# EAGLE design esp32-tft+gps (EAGLE 9.6.2)
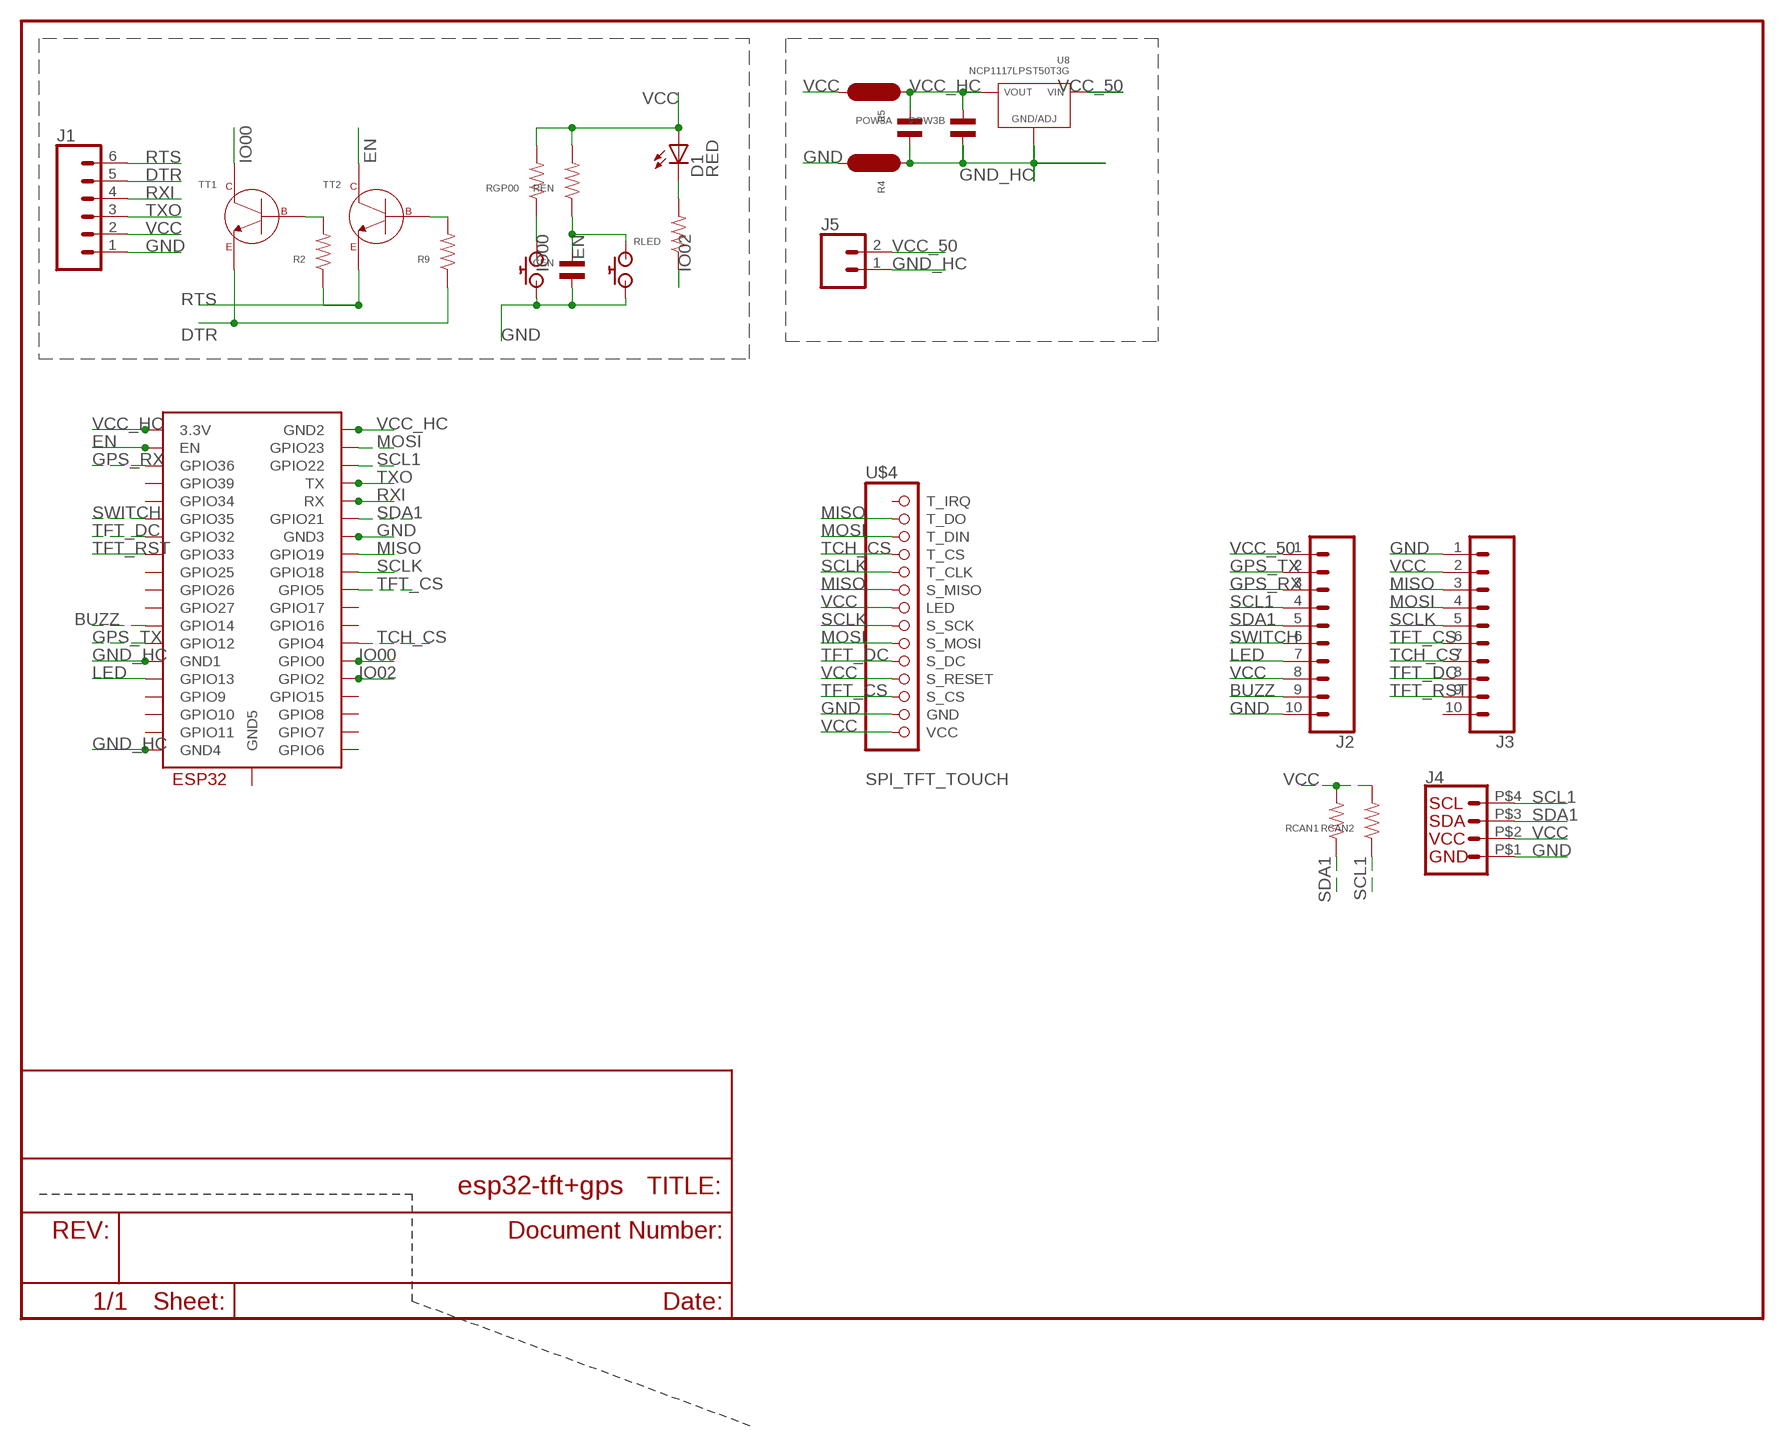
[diagram p0: schematic, sheet 1]

## Parts
CEN  CAPACITOR_NP_0603  [C0603]
D1  RED  LED-RED0603  [LED-0603]
J1  CONN_06  [1X6-1.25MM-SMD]
J2  CONN_10  [1X10-1.25MM]
J3  CONN_10  [1X10-1.25MM]
J4  Vertical Qwiic Connector  QWIIC_CONNECTORJST04_1MM_HOLE  [JST04_1MM_HOLES]
J5  CONN_02  [1X02]
POW3A  CAPACITOR_NP_0603  [C0603]
POW3B  CAPACITOR_NP_0603  [C0603]
R2  RESISTOR_0603  [R0603]
R4  JUMPER  [R0603_JMP]
R5  JUMPER  [R0603_JMP]
R9  RESISTOR_0603  [R0603]
RCAN1  RESISTOR_0603  [R0603]
RCAN2  RESISTOR_0603  [R0603]
REN  RESISTOR_0603  [R0603]
RGP00  RESISTOR_0603  [R0603]
RLED  RESISTOR_0603  [R0603]
TT1  MF-DSC-SOT233-MMBT3904  NPN_BJTMMBT3904_SOT-23-3  [SOT-23-3]
TT2  MF-DSC-SOT233-MMBT3904  NPN_BJTMMBT3904_SOT-23-3  [SOT-23-3]
U8  NCP1117LPST50T3G  [SOT-223-3]
U$1  AMAZON_BUTTONB2010  [C2010]
U$2  AMAZON_BUTTONB2010  [C2010]
U$3  ESP32-WROOM  [ESP32-WROOM]
U$4  SPI_TFT_TOUCH  [1X14_ROUND_70]

## Nets
BUZZ: J2.9 U$3.IO14(GPIO14)
DTR: J1.5 R9.P$1 TT1.P$2(EMITTER)
EN: CEN.P$1 REN.P$1 TT2.P$3(COLLECTOR) U$2.P$1 U$3.EN
GND: CEN.P$2 J1.1 J2.10 J3.1 J4.P$1 R4.P$2 U$1.P$2 U$2.P$2 U$3.GND3 U$4.13(GND)
GND_HC [hc]: J5.1 POW3A.P$2 POW3B.P$2 R4.P$1 U8.P$2(GND/ADJ) U$3.GND1 U$3.GND4
GPS_RX: J2.3 U$3.SENSOR_VP(GPIO36)
GPS_TX: J2.2 U$3.IO12(GPIO12)
IO00: RGP00.P$1 TT1.P$3(COLLECTOR) U$1.P$1 U$3.IO0(GPIO0)
IO02: RLED.P$1 U$3.IO2(GPIO2)
LED: J2.7 U$3.IO13(GPIO13)
MISO: J3.3 U$3.IO19(GPIO19) U$4.2(T_DO) U$4.6(S_MISO)
MOSI: J3.4 U$3.IO23(GPIO23) U$4.3(T_DIN) U$4.9(S_MOSI)
N$2: D1.C RLED.P$2
N$3: R2.P$2 TT1.P$1(BASE)
N$6: R9.P$2 TT2.P$1(BASE)
RTS: J1.6 R2.P$1 TT2.P$2(EMITTER)
RXI: J1.4 U$3.RX
SCL1: J2.4 J4.P$4 RCAN2.P$1 U$3.IO22(GPIO22)
SCLK: J3.5 U$3.IO18(GPIO18) U$4.5(T_CLK) U$4.8(S_SCK)
SDA1: J2.5 J4.P$3 RCAN1.P$1 U$3.IO21(GPIO21)
SWITCH: J2.6 U$3.IO35(GPIO35)
TCH_CS: J3.7 U$3.IO4(GPIO4) U$4.4(T_CS)
TFT_CS: J3.6 U$3.IO5(GPIO5) U$4.12(S_CS)
TFT_DC: J3.8 U$3.IO32(GPIO32) U$4.10(S_DC)
TFT_RST: J3.9 U$3.IO33(GPIO33)
TXO: J1.3 U$3.TX
VCC: D1.A J1.2 J2.8 J3.2 J4.P$2 R5.P$2 RCAN1.P$2 RCAN2.P$2 REN.P$2 RGP00.P$2 U$4.7(LED) U$4.11(S_RESET) U$4.14(VCC)
VCC_50 [hc]: J2.1 J5.2 U8.P$4(VIN)
VCC_HC [hc]: POW3A.P$1 POW3B.P$1 R5.P$1 U8.P$1(VOUT) U8.P$3(VOUT) U$3.3V3(3.3V) U$3.GND2
Unconnected: J3.10 U$3.CLK(GPIO6) U$3.CMD(GPIO11) U$3.GND5 U$3.IO15(GPIO15) U$3.IO16(GPIO16) U$3.IO17(GPIO17) U$3.IO25(GPIO25) U$3.IO26(GPIO26) U$3.IO27(GPIO27) U$3.IO34(GPIO34) U$3.SD0(GPIO7) U$3.SD1(GPIO8) U$3.SD2(GPIO9) U$3.SD3(GPIO10) U$3.SENSOR_VN(GPIO39) U$4.1(T_IRQ)

## Library data of the parts
CEN POW3A POW3B = MF_Passives:CAPACITOR_NP: Library: MF_Passives Description: Device for Non-Polarized Capacitors. Manufacture part number (MPN) can be added via Attributes. Check https://factory.macrofab.com/parts for the house parts list.; POPULATE: 1
D1 = 00jim:LED-RED: Assorted Red LEDs LilyPad 1206- DIO-09912 1206- DIO-00809 0603- DIO-00819; PROD_ID: DIO-00819
J1 = 00jim:CONN_06: Multi connection point. Often used as Generic Header-pin footprint for 0.1 inch spaced/style header connections On any of the 0.1 inch spaced packages, you can populate with these: Break Away Headers - Straight <https://www.sparkfun.com/products/116> (PRT-00116) Break Away Male Headers - Right Angle <https://www.sparkfun.com/products/553> (PRT-00553) Female Headers <https://www.sparkfun.com/products/115> (PRT-00115) Break Away Headers - Machine Pin <https://www.sparkfun.com/products/117> (PRT-00117) Break Away Female Headers - Swiss Machine Pin <https://www.sparkfun.com/products/743> (PRT-00743) Arduino Stackable Header - 6 Pin <https://www.sparkfun.com/products/9280> (PRT-09280) For SCREWTERMINALS and SPRING TERMINALS visit here: Screw Terimnals on SparkFun.com <https://www.sparkfun.com/search/results?term=Screw+Terminals> (5mm/3.5mm/2.54mm spacing) This device is also useful as a general connection point to wire up your design to another part of your project. Our various solder wires solder well into these plated through hole pads. Hook-Up Wire - Assortment (Stranded, 22 AWG) <https://www.sparkfun.com/products/11375> (PRT-11375) Hook-Up Wire - Assortment (Solid Core, 22 AWG) <https://www.sparkfun.com/products/11367> (PRT-11367) View the entire wire category on our website here <https://www.sparkfun.com/categories/141>
J2 J3 = SparkFun-Connectors:CONN_10: Multi connection point. Often used as Generic Header-pin footprint for 0.1 inch spaced/style header connections On any of the 0.1 inch spaced packages, you can populate with these: Break Away Headers - Straight <https://www.sparkfun.com/products/116> (PRT-00116) Break Away Male Headers - Right Angle <https://www.sparkfun.com/products/553> (PRT-00553) Female Headers <https://www.sparkfun.com/products/115> (PRT-00115) Break Away Headers - Machine Pin <https://www.sparkfun.com/products/117> (PRT-00117) Break Away Female Headers - Swiss Machine Pin <https://www.sparkfun.com/products/743> (PRT-00743) Arduino Stackable Header - 10 Pin <https://www.sparkfun.com/products/11376> (PRT-11376) For SCREWTERMINALS and SPRING TERMINALS visit here: Screw Terimnals on SparkFun.com <https://www.sparkfun.com/search/results?term=Screw+Terminals> (5mm/3.5mm/2.54mm spacing) This device is also useful as a general connection point to wire up your design to another part of your project. Our various solder wires solder well into these plated through hole pads. Hook-Up Wire - Assortment (Stranded, 22 AWG) <https://www.sparkfun.com/products/11375> (PRT-11375) Hook-Up Wire - Assortment (Solid Core, 22 AWG) <https://www.sparkfun.com/products/11367> (PRT-11367) View the entire wire category on our website here <https://www.sparkfun.com/categories/141> Special notes: Molex polarized connector foot print use with SKU : PRT-08231 with associated crimp pins and housings. 1MM SMD Version SKU: PRT-10208 NOTES ON THE VARIANTS LOCK and LOCK_LONGPADS... This footprint was designed to help hold the alignment of a through-hole component (i.e. 6-pin header) while soldering it into place. You may notice that each hole has been shifted either up or down by 0.005 of an inch from it's more standard position (which is a perfectly straight line). This slight alteration caused the pins (the squares in the middle) to touch the edges of the holes. Because they are alternating, it causes a "brace" to hold the component in place. 0.005 has proven to be the perfect amount of "off-center" position when using our standard breakaway headers. Although looks a little odd when you look at the bare footprint, once you have a header in there, the alteration is very hard to notice. Also,if you push a header all the way into place, it is covered up entirely on the bottom side.
J4 = 00jim:QWIIC_CONNECTOR: SparkFun I2C Standard Qwiic Connector An SMD 1mm pitch JST connector makes it easy and quick (get it? Qwiic?) to connect I2C devices to each other. The Qwiic system <http://www.sparkfun.com/qwiic> enables fast and solderless connection between popular platforms and various sensors and actuators. We carry 200mm <https://www.sparkfun.com/products/14204>, 100mm <https://www.sparkfun.com/products/14205>, 50mm <https://www.sparkfun.com/products/14206>, and breadboard friendly <https://www.sparkfun.com/products/14207> Qwiic cables. We also offer 10 pcs strips <https://www.sparkfun.com/products/14323> the SMD connectors.
J5 = SparkFun-Connectors:CONN_02: Multi connection point. Often used as Generic Header-pin footprint for 0.1 inch spaced/style header connections On any of the 0.1 inch spaced packages, you can populate with these: Break Away Headers - Straight <https://www.sparkfun.com/products/116> (PRT-00116) Break Away Male Headers - Right Angle <https://www.sparkfun.com/products/553> (PRT-00553) Female Headers <https://www.sparkfun.com/products/115> (PRT-00115) Break Away Headers - Machine Pin <https://www.sparkfun.com/products/117> (PRT-00117) Break Away Female Headers - Swiss Machine Pin <https://www.sparkfun.com/products/743> (PRT-00743) For SCREWTERMINALS and SPRING TERMINALS visit here: Screw Terimnals on SparkFun.com <https://www.sparkfun.com/search/results?term=Screw+Terminals> (5mm/3.5mm/2.54mm spacing) This device is also useful as a general connection point to wire up your design to another part of your project. Our various solder wires solder well into these plated through hole pads. Hook-Up Wire - Assortment (Stranded, 22 AWG) <https://www.sparkfun.com/products/11375> (PRT-11375) Hook-Up Wire - Assortment (Solid Core, 22 AWG) <https://www.sparkfun.com/products/11367> (PRT-11367) View the entire wire category on our website here <https://www.sparkfun.com/categories/141> Special notes: Molex polarized connector foot print use with: PRT-08233 with associated crimp pins and housings. 2.54_SCREWTERM for use with PRT-10571. 3.5mm Screw Terminal footprints for PRT-08084 5mm Screw Terminal footprints for use with PRT-08432
R2 R9 RCAN1 RCAN2 REN RGP00 RLED = 00jim:RESISTOR: Library: MF_Passives Description: Device for Resistors. Manufacture part number (MPN), Voltage, Tolerance, and Wattage Rating can be added via Attributes. Check https://factory.macrofab.com/parts for the house parts list.; POPULATE: 1
R4 R5 = 00jim:JUMPER: Library: MF_Passives Description: Device for Resistors. Manufacture part number (MPN), Voltage, Tolerance, and Wattage Rating can be added via Attributes. Check https://factory.macrofab.com/parts for the house parts list.
TT1 TT2 = MF_Discrete_Semiconductor:NPN_BJT: Library: MF_Discrete_Semiconductor Description: Device for Single NPN BJT Transistors. Manufacture part number (MFG#) can be added via Attributes.; HOUSEPART: YES; MPN: MF-DSC-SOT233-MMBT3904; POPULATE: 1; URL: https://factory.macrofab.com/part/MF-DSC-SOT233-MMBT3904
U8 = MF_IC_Power:NCP1117LP: Manufacturer Part #: NCP1117LP Manufacturer: ON Semiconductor Description: LDO Voltage Regulators; HOUSEPART: NO; MPN: NCP1117LPST50T3G; POPULATE: 1; URL: http://www.onsemi.com/pub_link/Collateral/NCP1117LP-D.PDF
U$1 U$2 = 00jim:AMAZON_BUTTON
U$3 = ESP32:ESP32-WROOM
U$4 = 00jim:SPI_TFT_TOUCH

## Net classes
0 default: width 0.229 mm
1 vcc: width 0.254 mm
3 hc: width 0.508 mm

## Board
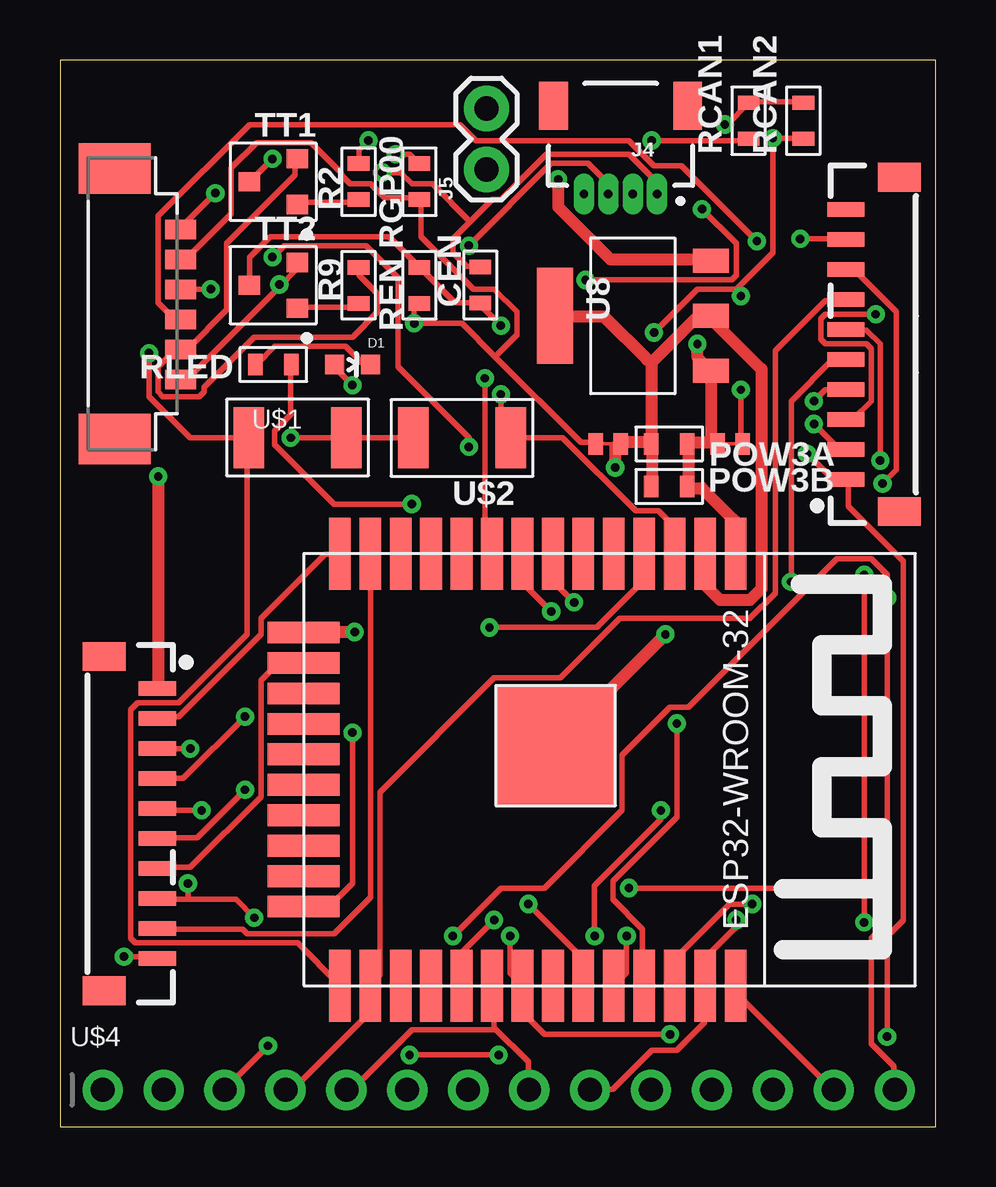
[diagram p1: board, top side]
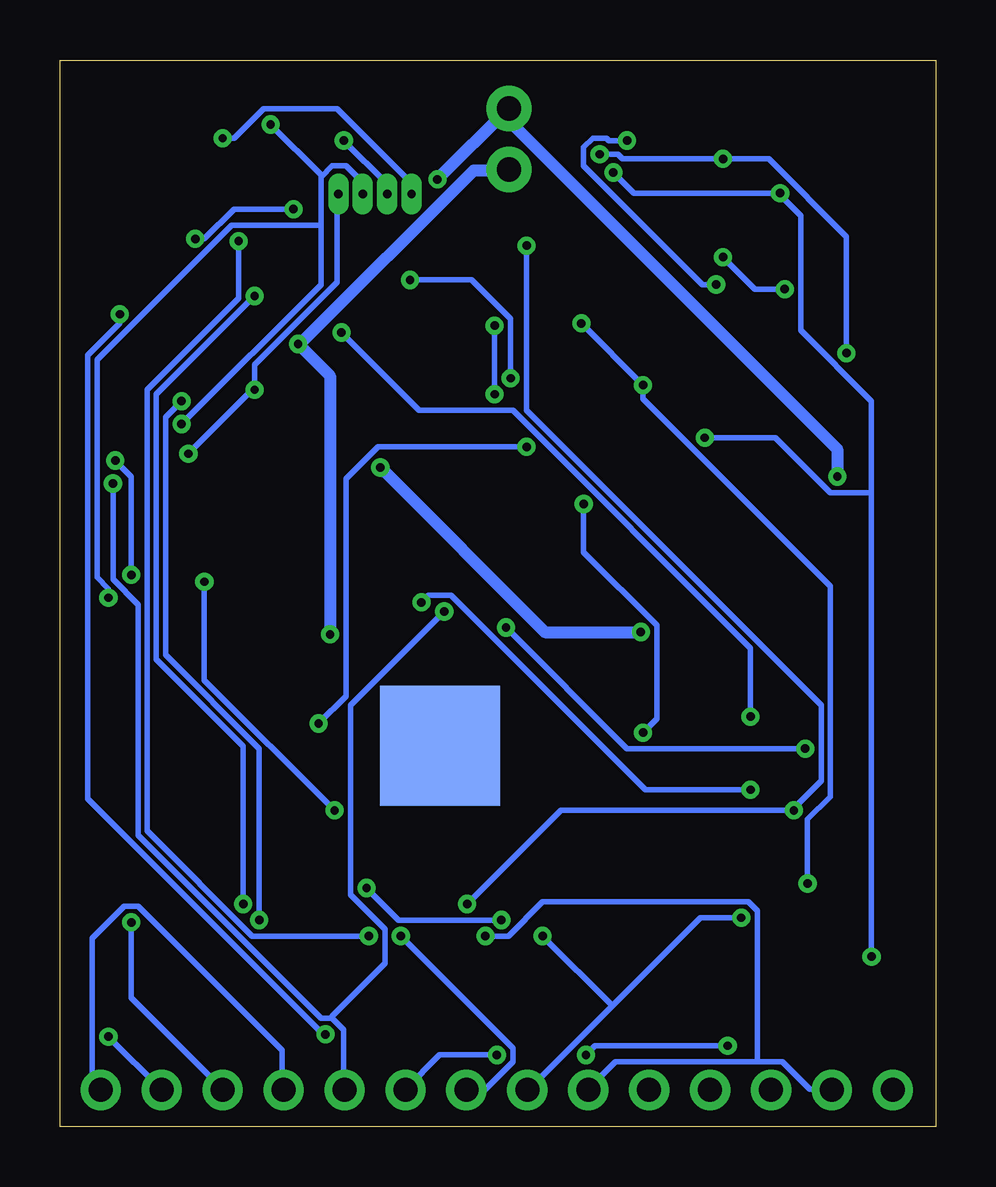
[diagram p2: board, bottom side, seen from below]

Size 36.5 x 44.44 mm. Coordinates in mm from the lower left corner, seen from the top.
Outline: 0,0 36.5,0 36.5,44.44 0,44.44 0,0
Copper layers (1*16): Top 0.035mm / dielectric 1.5mm / Bottom 0.035mm
Design rules "default *": minimum track width 6mil, minimum drill 0.35mm, track to track 6mil, track to pad 6mil, pad to pad 6mil, via to via 6mil, smd to smd 6mil, copper to edge 40mil, drill to drill 6mil, minimum pad ring 10mil, minimum via ring 8mil, stop-mask expansion 4mil, vias tented up to drill 30mil, thermal gap 10mil

### Footprints (pad centres in the part's own frame; a part is rotated, then mirrored left to right if it is on the bottom)
C0603 = smd 0.6 x 0.9: P$1 -0.75,0; P$2 0.75,0
LED-0603 = smd 0.8 x 0.8: A 0,-0.75; C 0,0.75
1X6-1.25MM-SMD = smd 0.8 x 1.3: 1 -3.085,1.48; 2 -1.835,1.48; 3 -0.585,1.48; 4 0.665,1.48; 5 1.915,1.48; 6 3.165,1.48 | smd 2.1 x 3: NC1 -5.635,-1.27; NC2 5.635,-1.27
1X10-1.25MM = smd 0.6 x 1.55: 1 -3.778,2.54; 2 -2.528,2.54; 3 -1.278,2.54; 4 -0.028,2.54; 5 1.222,2.54; 6 2.472,2.54; 7 3.722,2.54; 8 4.972,2.54; 9 6.222,2.54; 10 7.472,2.54 | smd 1.2 x 1.8: P$1 -5.11,0.315; P$3 8.822,0.315
JST04_1MM_HOLES = smd 1.2 x 2: NC1 2.8,0.135; NC2 -2.8,0.135 | drill 0.35 pad 0.61 long: P$1 -1.524,3.81; P$2 -0.508,3.81; P$3 0.508,3.81; P$4 1.524,3.81
1X02 = drill 1.016 pad 1.88: 1 0,0; 2 2.54,0
R0603 = smd 0.6 x 0.9: P$1 -0.75,0; P$2 0.75,0
R0603_JMP = smd 0.6 x 0.9: P$1 0.52,0; P$2 -0.52,0
SOT-23-3 = smd 0.9 x 0.8: P$1 -1,0.95; P$2 -1,-0.95; P$3 1,0
SOT-223-3 = smd 1.5 x 4: P$1 3.25,0 | smd 1.5 x 1: P$2 -3.25,2.3; P$3 -3.25,0; P$4 -3.25,-2.3
C2010 = smd 1.27 x 2.54: P$1 -2.032,0; P$2 2.032,0
ESP32-WROOM = smd 3 x 0.9: 3V3 0,16.74; EN 0,15.47; GND1 0,18.01; GND3 18,18.01; IO0 18,1.5; IO4 18,2.77; IO5 18,6.58; IO12 0,1.5; IO14 0,2.77; IO16 18,4.04; IO17 18,5.31; IO18 18,7.85; IO19 18,9.12; IO21 18,11.66; IO22 18,15.47; IO23 18,16.74; IO25 0,6.58; IO26 0,5.31; IO27 0,4.04; IO32 0,9.12; IO33 0,7.85; IO34 0,11.66; IO35 0,10.39; NC 18,10.39; RX 18,12.93; SENSOR_VN 0,12.93; SENSOR_VP 0,14.2; TX 18,14.2 | smd 0.9 x 3: CLK 9.635,0; CMD 8.365,0; GND2 3.285,0; IO2 14.715,0; IO13 4.555,0; IO15 13.445,0; SD0 10.905,0; SD1 12.175,0; SD2 5.825,0; SD3 7.095,0 | smd 5 x 5: GND4 8,10.5 | smd 5 x 5 bottom: GND5 8,10.5
1X14_ROUND_70 = drill 1 pad 1.676: 1 -17.78,0; 2 -15.24,0; 3 -12.7,0; 4 -10.16,0; 5 -7.62,0; 6 -5.08,0; 7 -2.54,0; 8 0,0; 9 2.54,0; 10 5.08,0; 11 7.62,0; 12 10.16,0; 13 12.7,0; 14 15.24,0

### Placement (x,y rotation side)
CEN  17.53,35.06 90 top
D1  12.19,31.75 270 top
J1  3.56,34.29 270 top
J2  1.52,14.48 270 top
J3  35.31,30.73 90 top
J4  23.37,42.67 180 top
J5  17.78,39.88 90 top
POW3A  25.4,28.45 0 top
POW3B  25.4,26.67 0 top
R2  12.45,39.37 270 top
R4  27.94,28.45 180 top
R5  22.86,28.45 0 top
R9  12.45,35.05 270 top
RCAN1  28.7,41.91 90 top
RCAN2  30.99,41.91 90 top
REN  14.99,35.05 270 top
RGP00  14.99,39.37 270 top
RLED  8.89,31.75 180 top
TT1  8.89,39.37 180 top
TT2  8.89,35.05 180 top
U8  23.88,33.78 180 top
U$1  9.91,28.7 0 top
U$2  16.76,28.7 180 top
U$3  10.16,23.88 270 top
U$4  19.56,1.52 0 top

### Tracks (layer width: path | path; a pad name or v marks a point on that pad's centre or on a via)
BUZZ
  Top 0.229: J2.9 4.1,8.22 7.62,8.22 7.81,8.03 11.43,8.03 12.95,9.56 12.95,23.84 U$3.IO14
DTR
  Top 0.229: R9.P$1 12.48,35.75 12.48,35.47 13.24,34.7 13.24,33.94 12.19,32.89 8.1,32.89 6,30.8 6,30.61 5.81,30.42 4.29,30.42 4.1,30.61 4.1,31.66 4.76,32.32 4.95,32.32 J1.5 5.14,32.42 5.33,32.42 6.95,34.04 6.95,36.8 9.81,39.66 9.81,40.23 TT1.P$2
EN  (via drill 0.35)
  Top 0.229: TT2.P$3 7.91,35.08 7.91,36.23 8.76,37.08 13.72,37.08 14.95,35.85 REN.P$1 15.05,35.75 16.48,34.32 CEN.P$1 17.53,34.23 v18.38,33.37 | U$3.EN 25.62,23.94 25.62,24.99 24.95,25.65 24,25.65 20.95,28.7 U$2.P$1 18.76,28.8 18.38,29.18 v18.38,30.51
  Bottom 0.229: v18.38,30.51 v18.38,33.37
GND  (via drill 0.35)
  Top 0.229: U$3.GND3 28.19,5.84 28.19,5.56 32.19,1.56 U$4.13 | U$2.P$2 U$1.P$2 v9.62,28.7 | 17.1,37.7 18,38.61 18.38,38.61 20.29,40.51 23.72,40.51 24.86,39.37 24.86,38.89 J4.P$1 | 17.1,37.7 16.38,36.99 16.38,36.42 16.95,35.85 17.53,35.85 CEN.P$2 | v28.38,30.7 28.38,28.51 R4.P$2 | v6.48,38.89 5.05,37.47 J1.1 | v13.43,39.75 14.19,39.75 14.67,39.27 15.53,39.27 17.1,37.7 | v2.67,7.08 4,7.08 J2.10 | v31.15,28.04 32.19,26.99 32.77,26.99 J3.1 32.86,26.89 32.86,25.84 35.15,23.56 35.15,8.6 34.48,7.94 v34.48,3.75
  Bottom 0.229: J4.P$1 24.95,38.8 24.95,35.18 28.38,31.75 v28.38,30.7 28.48,30.7 v31.15,28.04 | v13.43,39.75 12.57,38.89 v6.48,38.89 6.48,38.8 5.62,37.94 5.62,33.18 2.67,30.23 2.67,26.42 | 2.67,26.42 v2.67,7.08 | v9.62,28.7 6.67,28.7 4.38,26.42 2.67,26.42 | v34.48,3.75 U$4.13
GND_HC  (via drill 0.35)
  Top 0.508: U$3.GND1 28.1,23.94 28.1,25.27 26.76,26.61 26.38,26.61 POW3B.P$2 26.19,26.7 26.19,28.42 POW3A.P$2 26.38,28.51 27.34,28.51 R4.P$1 27.15,28.7 27.15,31.46 U8.P$2 26.96,31.66 26.57,32.04 v26.57,32.61 | v25.24,20.51 20.67,15.94 U$3.GND4
  Bottom 0.508: J5.1 17.81,39.85 19.24,39.85 26.48,32.61 v26.57,32.61 25.24,31.27 v25.24,20.51
GPS_RX  (via drill 0.35)
  Top 0.229: v5.43,15.75 4.1,15.75 J2.3 | v17.91,20.8 22.38,20.8 24.29,22.7 24.29,23.84 U$3.SENSOR_VP
  Bottom 0.229: v5.43,15.75 12.86,15.75 v17.91,20.8
GPS_TX
  Top 0.229: J2.2 4.1,17.08 4.95,17.08 8.38,20.51 8.38,21.18 11.05,23.84 11.62,23.84 U$3.IO12
IO00  (via drill 0.35)
  Top 0.229: v8.86,40.32 7.91,39.37 TT1.P$3 | v14,40.51 14.57,40.51 14.95,40.13 RGP00.P$1 | U$3.IO0 11.62,5.94 9.91,7.65 3.14,7.65 2.95,7.84 2.95,17.37 3.24,17.65 4.95,17.65 7.81,20.51 7.81,28.7 U$1.P$1 5.43,28.7 3.72,30.42 v3.72,32.23
  Bottom 0.229: v14,40.51 13.24,40.51 13.05,40.32 v8.86,40.32 6.95,40.32 3.72,37.08 v3.72,32.23
IO02  (via drill 0.35)
  Top 0.229: v14.67,25.94 11.43,25.94 8.95,28.42 8.95,28.99 9.62,29.66 9.62,31.75 RLED.P$1 | v12.19,16.42 12.19,10.13 11.24,9.18 10.19,9.18 U$3.IO2
  Bottom 0.229: v14.67,25.94 14.67,23.94 11.62,20.89 11.62,16.99 v12.19,16.42
LED
  Top 0.229: J2.7 4.1,10.79 5.43,10.79 8.38,13.75 8.38,18.61 9.05,19.27 10.1,19.27 U$3.IO13
MISO  (via drill 0.35)
  Top 0.229: v34,33.84 31.91,33.84 31.72,33.66 31.72,32.8 31.91,32.61 33.62,32.61 33.81,32.42 33.81,30.23 33.05,29.46 32.77,29.46 J3.3 | v25.43,3.84 20.19,3.84 19.34,4.7 19.34,5.84 U$3.IO19 19.24,5.94 18.76,6.41 v18.76,7.94
  Bottom 0.229: 7.43,2.7 13.34,2.7 14.48,1.56 U$4.6 | 7.43,2.7 6.38,2.7 5.24,1.56 4.38,1.56 U$4.2 | v34,33.84 34,33.46 35.34,32.13 35.34,13.65 25.53,3.84 v25.43,3.84 | 7.43,2.7 7.43,8.98 7.81,9.37 16.38,9.37 17.81,7.94 v18.76,7.94
MOSI  (via drill 0.35)
  Top 0.229: v8.67,3.37 6.86,1.56 U$4.3 | v18.29,2.98 v14.57,2.98 | v31.43,30.23 31.91,30.7 J3.4 | v28.19,8.6 28.19,8.32 26.96,7.08 26.96,5.94 U$3.IO23 26.86,5.84 26.86,4.32 25.72,3.18 24.67,3.18 23.05,1.56 22.1,1.56 U$4.9
  Bottom 0.229: v8.67,3.37 14.19,3.37 v14.57,2.98 | v18.29,2.98 20.67,2.98 22.1,1.56 U$4.9 | v31.43,30.23 32.1,29.56 32.1,19.65 28.19,15.75 v28.19,8.6
N$1
  Top 0.152: 22.61,28.45 23.11,28.45
N$2
  Top 0.229: D1.C 12.67,31.75 11.91,32.51 8.95,32.51 8.19,31.75 RLED.P$2
N$3
  Top 0.229: TT1.P$1 9.91,38.51 12.29,38.51 12.38,38.61 R2.P$2
N$4
  Top 0.152: 27.69,28.45 28.19,28.45
N$6
  Top 0.229: TT2.P$1 9.91,34.13 12.29,34.13 12.38,34.23 R9.P$2
RTS  (via drill 0.35)
  Top 0.229: 9.19,35.04 5.33,31.18 5.05,31.18 J1.6 | 9.19,35.04 9.81,35.66 9.81,35.94 TT2.P$2 | v12.86,41.08 12.48,40.7 12.48,40.13 R2.P$1 | v9.14,35.08 9.19,35.04
  Bottom 0.229: v12.86,41.08 13.62,41.08 13.72,41.18 14.29,41.18 14.67,40.8 14.67,40.04 9.72,35.08 v9.14,35.08
RXI  (via drill 0.35)
  Top 0.229: v29.05,36.89 25.91,40.04 24.76,40.04 23.72,41.08 17.34,41.08 16.67,41.75 7.91,41.75 4.1,37.94 4.1,34.32 4.76,33.66 4.95,33.66 J1.4 | v23.62,7.94 23.62,6.41 23.15,5.94 U$3.RX
  Bottom 0.229: v29.05,36.89 29.05,34.51 32.86,30.7 32.86,12.32 28.48,7.94 v23.62,7.94
SCL1  (via drill 0.35)
  Top 0.229: RCAN2.P$1 30.96,41.18 v29.72,41.18 29.72,36.42 28.19,34.89 | v7.71,17.08 5.14,14.51 4.1,14.51 J2.4 | v24.76,33.08 26.57,34.89 28.19,34.89 | v28.86,9.27 27.91,9.27 25.72,7.08 25.72,5.94 U$3.IO22 | v28.38,34.61 28.19,34.8 28.19,34.89
  Bottom 0.229: v29.72,41.18 29.24,41.18 28,42.42 24.95,42.42 21.91,39.37 21.91,38.89 J4.P$4 | v7.71,17.08 7.71,19.94 17.62,29.85 21.53,29.85 v24.76,33.08 | v28.86,9.27 28.86,15.84 32.48,19.46 32.48,30.51 v28.38,34.61
SCLK  (via drill 0.35)
  Top 0.229: v30.48,22.7 30.48,30.23 32.19,31.94 32.77,31.94 J3.5 | v25.05,13.18 25.05,12.79 22.29,10.03 v22.29,7.94 | 18.1,4.13 18.1,5.84 U$3.IO18 | 18.1,4.13 19.53,2.7 19.53,1.56 U$4.8 | U$4.5 12,1.56 12.19,1.56 14.67,4.03 18.1,4.03 18.1,4.13
  Bottom 0.229: v30.48,22.7 30.48,18.61 v25.05,13.18 | v22.29,7.94 17.62,3.27 17.62,2.7 18.76,1.56 19.53,1.56 U$4.8
SDA1  (via drill 0.35)
  Top 0.229: v24.67,41.08 28.67,41.08 RCAN1.P$1 | v5.91,13.18 4.1,13.18 J2.5 | v19.53,9.27 21.81,6.98 21.81,5.94 U$3.IO21 | J4.P$3 22.86,39.27 22,40.13 20.48,40.13 v17.05,36.7
  Bottom 0.229: v24.67,41.08 22.86,39.27 J4.P$3 | v19.53,9.27 15.62,13.18 v5.91,13.18 5.91,13.27 4.76,14.41 4.76,17.56 17.05,29.85 v17.05,36.7
SWITCH  (via drill 0.35)
  Top 0.229: v7.71,14.03 5.71,12.03 4.1,12.03 J2.6 | v21.43,21.84 20.57,22.7 20.57,23.84 U$3.IO35
  Bottom 0.229: v7.71,14.03 12.1,14.03 20.19,22.13 21.14,22.13 v21.43,21.84
TCH_CS
  Top 0.229: J3.7 32.77,34.42 31.91,34.42 29.81,32.32 29.81,22.23 28.77,21.18 23.34,21.18 20.86,18.7 18.1,18.7 13.34,13.94 13.34,6.32 12.95,5.94 U$3.IO4 12.86,5.84 12.86,4.7 9.72,1.56 9.43,1.56 U$4.4
TFT_CS  (via drill 0.35)
  Top 0.229: v34.2,27.75 34.2,32.61 33.62,33.18 32.77,33.18 J3.6 | v33.53,8.51 33.53,9.94 | 33.53,9.94 v33.53,22.99 | v18.1,8.6 16.76,7.27 16.76,5.94 U$3.IO5 | 33.53,9.94 v23.72,9.94
  Bottom 0.229: v34.2,27.75 33.53,27.08 v33.53,22.99 | v33.53,8.51 33.53,5.37 29.72,1.56 U$4.12 | v18.1,8.6 22.38,8.6 v23.72,9.94
TFT_DC  (via drill 0.35)
  Top 0.229: v34.29,26.8 34.86,27.37 34.86,33.94 33.15,35.66 32.77,35.66 J3.8 | v20.48,21.46 19.34,22.61 19.34,23.84 U$3.IO32
  Bottom 0.229: v34.29,26.8 34.29,22.8 33.24,21.75 33.24,12.13 25.62,4.51 25.15,4.51 | 25.15,4.51 24.67,4.03 24.67,1.56 U$4.10 | v20.48,21.46 24.38,17.56 24.38,9.65 22.95,8.22 22.95,6.79 25.15,4.6 25.15,4.51
TFT_RST  (via drill 0.35)
  Top 0.229: v30.86,36.99 32.77,36.99 J3.9 | v26.76,38.23 28.19,36.8 28.19,35.47 28,35.27 v21.91,35.27 | v17.72,31.18 17.72,24.23 18,23.94 U$3.IO33
  Bottom 0.229: v30.86,36.99 30.48,36.99 29.24,38.23 v26.76,38.23 | v21.91,35.27 19.34,35.27 17.72,33.66 v17.72,31.18
TXO  (via drill 0.35)
  Top 0.229: v6.29,34.89 5.05,34.89 J1.3 | v8.86,36.23 9.33,36.7 12.76,36.7 14.1,35.37 14.1,31.66 17.05,28.7 v17.05,28.32 | v25.72,16.8 25.72,12.89 23.05,10.22 23.05,9.46 24.29,8.22 24.29,5.94 U$3.TX
  Bottom 0.229: v6.29,34.89 7.53,34.89 v8.86,36.23 | v17.05,28.32 23.24,28.32 24.57,26.99 24.57,17.94 v25.72,16.8
VCC  (via drill 0.35)
  Top 0.229: RCAN2.P$2 30.96,42.7 28.77,42.7 RCAN1.P$2 28.67,42.61 27.81,41.75 v27.72,41.75 | v31.43,29.27 32.48,28.23 32.77,28.23 J3.2 | U$4.14 34.77,1.56 34.77,2.51 33.81,3.46 33.81,7.84 34.48,8.51 v34.48,22.03 34.48,22.99 33.81,23.65 32.38,23.65 26.19,17.46 25.43,17.46 23.43,15.46 23.43,13.18 20.19,9.94 18.38,9.94 v16.38,7.94 | 5.33,9.46 7.33,9.46 v8.1,8.7 | 5.33,9.46 4.1,9.46 J2.8 | v12.19,30.89 11.53,31.56 11.53,31.75 D1.A | REN.P$2 14.95,34.23 14.76,34.04 v14.76,33.46 16.76,33.46 18.14,32.08 | 18.14,32.08 21.72,28.51 22.29,28.51 R5.P$2 | 18.14,32.08 19.05,32.99 19.05,33.94 18.1,34.89 17.24,34.89 15.05,37.08 15.05,38.61 RGP00.P$2 14.95,38.7 13.53,38.7 12.95,39.27 12.1,39.27 11.72,39.66 11.72,39.75 10.48,40.99 8.19,40.99 7.14,39.94 7.14,38.04 5.24,36.13 5.05,36.13 J1.2 | v5.33,10.13 5.33,9.46
  Bottom 0.229: U$4.11 27.24,1.56 27.24,3.18 33.24,9.18 33.81,9.18 35.15,7.84 35.15,1.84 34.86,1.56 U$4.14 | v31.43,29.27 25.62,35.08 25.62,37.56 | 25.62,39.56 25.62,37.56 | 25.62,39.56 25.15,40.04 24.57,40.04 23.91,39.37 23.91,38.89 J4.P$2 | v27.72,41.75 25.62,39.66 25.62,39.56 | v34.48,22.03 34.48,22.42 34.96,22.89 34.96,31.94 29.34,37.56 25.62,37.56 | v8.1,8.7 9.81,8.7 13.48,5.03 | 13.48,5.03 16.95,1.56 U$4.7 | v14.76,33.46 v12.19,30.89 12.19,30.32 4.38,22.51 4.38,13.75 5.33,12.79 v5.33,10.13 | 13.48,5.03 v16.38,7.94
VCC_50  (via drill 0.35)
  Top 0.508: v20.76,39.47 20.76,38.32 22.95,36.13 27.05,36.13 U8.P$4 | v4.1,27.08 4.1,18.32 J2.1
  Bottom 0.508: v20.76,39.47 17.81,42.42 J5.2 17.91,42.04 4.1,28.23 v4.1,27.08
VCC_HC  (via drill 0.35)
  Top 0.508: POW3A.P$1 24.57,28.51 23.43,28.51 R5.P$1 23.15,28.32 v23.15,27.46 | POW3B.P$1 24.67,26.7 24.67,28.23 POW3A.P$1 | 24.67,31.84 26.57,33.75 27.05,33.75 U8.P$3 27.24,33.56 29.24,31.56 29.24,22.42 28.77,21.94 27.53,21.94 26.96,22.51 26.96,23.84 U$3.3V3 | 24.67,31.84 24.67,28.7 POW3A.P$1 | v12.29,20.61 10.19,20.61 U$3.GND2 | U8.P$1 20.67,33.75 22.67,33.75 24.48,31.94 24.67,31.84
  Bottom 0.508: v12.29,20.61 16.29,20.61 v23.15,27.46